# Altium schematic sheet 2_P2.schdoc
size 309 x 223 mm
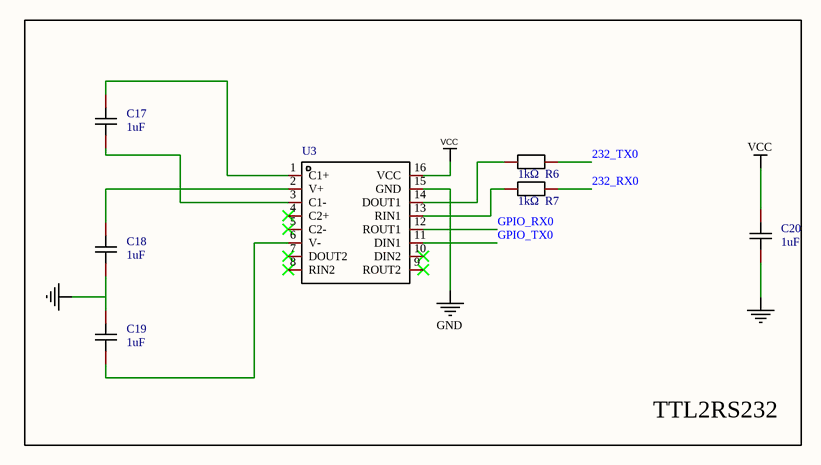
[diagram p0: 2_P2.schdoc]

## Parts
C17  value 1uF  [C0402]  (hidden comment: CL05A225MQ5NNNC)
C18  value 1uF  [C0402]  (hidden comment: CL05A225MQ5NNNC)
C19  value 1uF  [C0402]  (hidden comment: CL05A225MQ5NNNC)
C20  value 1uF  [C0402]  (hidden comment: CL05A225MQ5NNNC)
R6  value 1kΩ  [R0402]  (hidden comment: CR0402J1K00Q10Z)
R7  value 1kΩ  [R0402]  (hidden comment: CR0402J1K00Q10Z)
U3  CBM3232AS16  [SOP-16_L10.0-W3.9-P1.27-LS6.0-BL]  (value not drawn)

## Blocks framed on the sheet
TTL2RS232: C17-C20 R6 R7 U3

## Nets
GND: C18.2 C19.1 C20.2 U3.15(GND)
VCC: C20.1 U3.16(VCC)
232_RX0: R7.2
232_TX0: R6.2
GPIO_RX0: U3.12(ROUT1)
GPIO_TX0: U3.11(DIN1)
NetC17_1: C17.1 U3.1(C1+)
NetC17_2: C17.2 U3.3(C1-)
NetC18_1: C18.1 U3.2(V+)
NetC19_2: C19.2 U3.6(V-)
NetR6_1: R6.1 U3.14(DOUT1)
NetR7_1: R7.1 U3.13(RIN1)

Not connected (* = marked no-connect by the designer): U3 4(C2+)* 5(C2-)* 7(DOUT2)* 8(RIN2)* 9(ROUT2)* 10(DIN2)*

## Library data of the parts
C17-C20 = CL05A225MQ5NNNC: 容值:2.2uF;精度:±20%;额定电压:6.3V;材质(温度系数):X5R;; Manufacturer: SAMSUNG(三星); Add into BOM: yes; Tolerance: ±20%; Voltage Rated: 6.3V; Temperature Coefficient: X5R; Symbol: CL05A225MQ5NNNC; Device: CL05A225MQ5NNNC; LCSC Part Name: 2.2uF ±20% 6.3V; Supplier Part: C107371; Manufacturer Part: CL05A225MQ5NNNC; Supplier Footprint: 0402; JLCPCB Part Class: Extended Part; Datasheet: https://atta.szlcsc.com/upload/public/pdf/source/20180125/C107371_15168614220061301441.pdf; Supplier: LCSC; Convert to PCB: yes
R6 R7 = CR0402J1K00Q10Z: 阻值:1kΩ;精度:±5%;功率:63mW;温度系数:±100ppm/;; Manufacturer: EVER OHMS(天二科技); Add into BOM: yes; Tolerance: ±5%; Power(Watts): 63mW; Symbol: CR0402J1K00Q10Z; Device: CR0402J1K00Q10Z; LCSC Part Name: 1kΩ ±5% 63mW; Supplier Part: C881213; Manufacturer Part: CR0402J1K00Q10Z; Supplier Footprint: 0402; JLCPCB Part Class: Extended Part; Datasheet: https://atta.szlcsc.com/upload/public/pdf/source/20201014/C881429_ABC29D63C8D6A11EB63D87348B25AA7B.pdf; Supplier: LCSC; Convert to PCB: yes; Temperature Coefficient: ±100ppm/
U3 = CBM3232AS16: 类型:-;协议类别:-;驱动器/接收器数:-;数据速率:-;; Manufacturer: Corebai(芯佰微); Add into BOM: yes; Symbol: CBM3232AS16; Device: CBM3232AS16; LCSC Part Name: CBM3232AS16; Supplier Part: C476467; Manufacturer Part: CBM3232AS16; Supplier Footprint: SOP-16; JLCPCB Part Class: Extended Part; Datasheet: https://atta.szlcsc.com/upload/public/pdf/source/20191226/C476467_7B1F3D9031946BD8263AE113AA301575.pdf; Supplier: LCSC; Convert to PCB: yes; Type: -; Protocol: -; Number of Drivers/Receivers: -; Data Rate: -; Supply Voltage: -